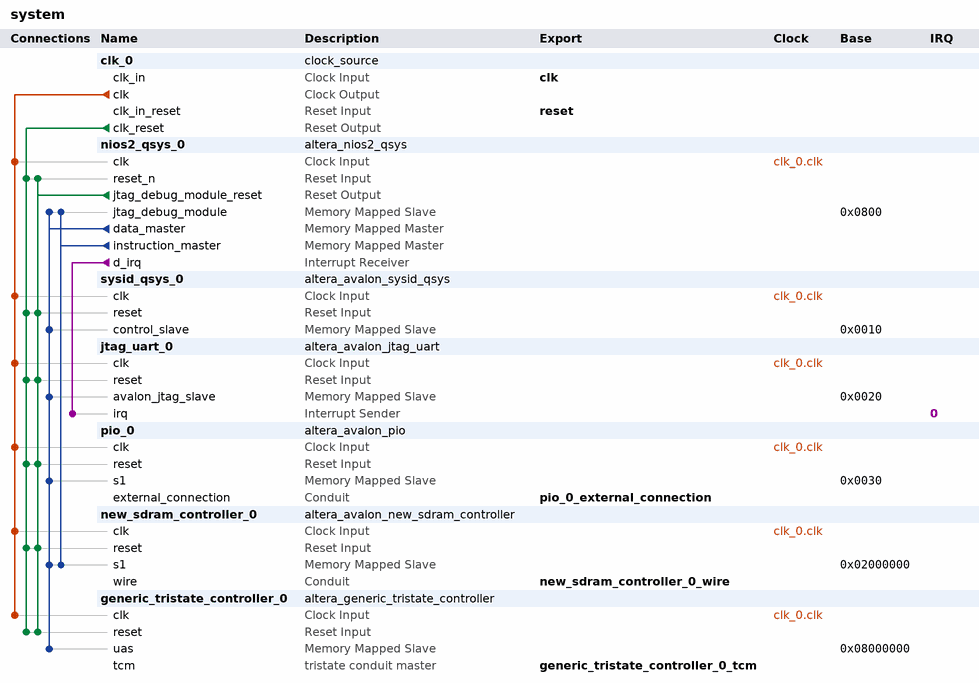
[diagram p0: system contents]
# Platform Designer (Qsys) system system, Cyclone IV E EP4CE22F17C6
# Parameters at their usual value, and those the tool derives, are not listed.
package require -exact qsys 14.0
create_system system
set_project_property DEVICE_FAMILY {Cyclone IV E}
set_project_property DEVICE EP4CE22F17C6

add_instance clk_0 clock_source 14.0
set_instance_parameter_value clk_0 clockFrequency 50000000

add_instance nios2_qsys_0 altera_nios2_qsys 14.0
set_instance_parameter_value nios2_qsys_0 resetrequest_enabled true
set_instance_parameter_value nios2_qsys_0 resetSlave new_sdram_controller_0.s1
set_instance_parameter_value nios2_qsys_0 mmu_TLBMissExcSlave None
set_instance_parameter_value nios2_qsys_0 exceptionSlave new_sdram_controller_0.s1
set_instance_parameter_value nios2_qsys_0 breakSlave nios2_qsys_0.jtag_debug_module
set_instance_parameter_value nios2_qsys_0 impl Tiny
set_instance_parameter_value nios2_qsys_0 icache_size 4096

add_instance sysid_qsys_0 altera_avalon_sysid_qsys 14.0
set_instance_parameter_value sysid_qsys_0 id 0

add_instance jtag_uart_0 altera_avalon_jtag_uart 14.0
set_instance_parameter_value jtag_uart_0 simInteractiveOptions NO_INTERACTIVE_WINDOWS

add_instance pio_0 altera_avalon_pio 14.0
set_instance_parameter_value pio_0 direction Output
set_instance_parameter_value pio_0 width 8

add_instance new_sdram_controller_0 altera_avalon_new_sdram_controller 14.0
set_instance_parameter_value new_sdram_controller_0 TAC 5.5
set_instance_parameter_value new_sdram_controller_0 TRCD 20.0
set_instance_parameter_value new_sdram_controller_0 TRP 20.0
set_instance_parameter_value new_sdram_controller_0 casLatency 3
set_instance_parameter_value new_sdram_controller_0 columnWidth 9
set_instance_parameter_value new_sdram_controller_0 dataWidth 16
set_instance_parameter_value new_sdram_controller_0 generateSimulationModel false
set_instance_parameter_value new_sdram_controller_0 model single_Micron_MT48LC4M32B2_7_chip
set_instance_parameter_value new_sdram_controller_0 numberOfBanks 4
set_instance_parameter_value new_sdram_controller_0 numberOfChipSelects 1
set_instance_parameter_value new_sdram_controller_0 powerUpDelay 100.0
set_instance_parameter_value new_sdram_controller_0 refreshPeriod 15.625
set_instance_parameter_value new_sdram_controller_0 rowWidth 13

add_instance generic_tristate_controller_0 altera_generic_tristate_controller 14.0
set_instance_parameter_value generic_tristate_controller_0 TCM_ADDRESS_W 10
set_instance_parameter_value generic_tristate_controller_0 TCM_DATA_W 8
set_instance_parameter_value generic_tristate_controller_0 TCM_BYTEENABLE_W 1
set_instance_parameter_value generic_tristate_controller_0 TCM_READ_WAIT 5
set_instance_parameter_value generic_tristate_controller_0 TCM_WRITE_WAIT 5
set_instance_parameter_value generic_tristate_controller_0 TCM_SETUP_WAIT 1
set_instance_parameter_value generic_tristate_controller_0 TCM_DATA_HOLD 1
set_instance_parameter_value generic_tristate_controller_0 TCM_MAX_PENDING_READ_TRANSACTIONS 1
set_instance_parameter_value generic_tristate_controller_0 TCM_TURNAROUND_TIME 2
set_instance_parameter_value generic_tristate_controller_0 TCM_TIMING_UNITS 1
set_instance_parameter_value generic_tristate_controller_0 TCM_READLATENCY 1
set_instance_parameter_value generic_tristate_controller_0 TCM_SYMBOLS_PER_WORD 1
set_instance_parameter_value generic_tristate_controller_0 USE_READ 1
set_instance_parameter_value generic_tristate_controller_0 USE_BEGINTRANSFER 0
set_instance_parameter_value generic_tristate_controller_0 USE_BYTEENABLE 0
set_instance_parameter_value generic_tristate_controller_0 USE_OUTPUTENABLE 0
set_instance_parameter_value generic_tristate_controller_0 ACTIVE_LOW_READ 0
set_instance_parameter_value generic_tristate_controller_0 ACTIVE_LOW_WRITE 0
set_instance_parameter_value generic_tristate_controller_0 ACTIVE_LOW_CHIPSELECT 0
set_instance_parameter_value generic_tristate_controller_0 ACTIVE_LOW_BYTEENABLE 0
set_instance_parameter_value generic_tristate_controller_0 ACTIVE_LOW_OUTPUTENABLE 0
set_instance_parameter_value generic_tristate_controller_0 ACTIVE_LOW_BEGINTRANSFER 0
set_instance_parameter_value generic_tristate_controller_0 CHIPSELECT_THROUGH_READLATENCY 0
set_instance_parameter_value generic_tristate_controller_0 IS_MEMORY_DEVICE 0
set_instance_parameter_value generic_tristate_controller_0 MODULE_ASSIGNMENT_KEYS embeddedsw.configuration.hwClassnameDriverSupportList
set_instance_parameter_value generic_tristate_controller_0 MODULE_ASSIGNMENT_VALUES "altera_avalon_lan91c111\\,altera_avalon_cfi_flash"

# connections
add_connection clk_0.clk generic_tristate_controller_0.clk clock
add_connection clk_0.clk jtag_uart_0.clk clock
add_connection clk_0.clk new_sdram_controller_0.clk clock
add_connection clk_0.clk nios2_qsys_0.clk clock
add_connection clk_0.clk pio_0.clk clock
add_connection clk_0.clk sysid_qsys_0.clk clock
add_connection clk_0.clk_reset generic_tristate_controller_0.reset reset
add_connection clk_0.clk_reset jtag_uart_0.reset reset
add_connection clk_0.clk_reset new_sdram_controller_0.reset reset
add_connection clk_0.clk_reset nios2_qsys_0.reset_n reset
add_connection clk_0.clk_reset pio_0.reset reset
add_connection clk_0.clk_reset sysid_qsys_0.reset reset
add_connection nios2_qsys_0.jtag_debug_module_reset generic_tristate_controller_0.reset reset
add_connection nios2_qsys_0.jtag_debug_module_reset jtag_uart_0.reset reset
add_connection nios2_qsys_0.jtag_debug_module_reset new_sdram_controller_0.reset reset
add_connection nios2_qsys_0.jtag_debug_module_reset nios2_qsys_0.reset_n reset
add_connection nios2_qsys_0.jtag_debug_module_reset pio_0.reset reset
add_connection nios2_qsys_0.jtag_debug_module_reset sysid_qsys_0.reset reset
add_connection nios2_qsys_0.data_master generic_tristate_controller_0.uas avalon
set_connection_parameter_value nios2_qsys_0.data_master/generic_tristate_controller_0.uas baseAddress 0x08000000
add_connection nios2_qsys_0.data_master jtag_uart_0.avalon_jtag_slave avalon
set_connection_parameter_value nios2_qsys_0.data_master/jtag_uart_0.avalon_jtag_slave baseAddress 0x0020
add_connection nios2_qsys_0.data_master new_sdram_controller_0.s1 avalon
set_connection_parameter_value nios2_qsys_0.data_master/new_sdram_controller_0.s1 baseAddress 0x02000000
add_connection nios2_qsys_0.data_master nios2_qsys_0.jtag_debug_module avalon
set_connection_parameter_value nios2_qsys_0.data_master/nios2_qsys_0.jtag_debug_module baseAddress 0x0800
add_connection nios2_qsys_0.data_master pio_0.s1 avalon
set_connection_parameter_value nios2_qsys_0.data_master/pio_0.s1 baseAddress 0x0030
add_connection nios2_qsys_0.data_master sysid_qsys_0.control_slave avalon
set_connection_parameter_value nios2_qsys_0.data_master/sysid_qsys_0.control_slave baseAddress 0x0010
add_connection nios2_qsys_0.instruction_master new_sdram_controller_0.s1 avalon
set_connection_parameter_value nios2_qsys_0.instruction_master/new_sdram_controller_0.s1 baseAddress 0x02000000
add_connection nios2_qsys_0.instruction_master nios2_qsys_0.jtag_debug_module avalon
set_connection_parameter_value nios2_qsys_0.instruction_master/nios2_qsys_0.jtag_debug_module baseAddress 0x0800
add_connection nios2_qsys_0.d_irq jtag_uart_0.irq interrupt
set_connection_parameter_value nios2_qsys_0.d_irq/jtag_uart_0.irq irqNumber 0

# exported interfaces
add_interface clk clock sink
set_interface_property clk EXPORT_OF clk_0.clk_in
add_interface reset reset sink
set_interface_property reset EXPORT_OF clk_0.clk_in_reset
add_interface pio_0_external_connection conduit end
set_interface_property pio_0_external_connection EXPORT_OF pio_0.external_connection
add_interface new_sdram_controller_0_wire conduit end
set_interface_property new_sdram_controller_0_wire EXPORT_OF new_sdram_controller_0.wire
add_interface generic_tristate_controller_0_tcm tristate_conduit start
set_interface_property generic_tristate_controller_0_tcm EXPORT_OF generic_tristate_controller_0.tcm

set_interconnect_requirement {$system} qsys_mm.clockCrossingAdapter HANDSHAKE
set_interconnect_requirement {$system} qsys_mm.maxAdditionalLatency 1
set_interconnect_requirement {$system} qsys_mm.insertDefaultSlave FALSE

save_system system.qsys
